# EAGLE design hub (EAGLE 7.5.0)
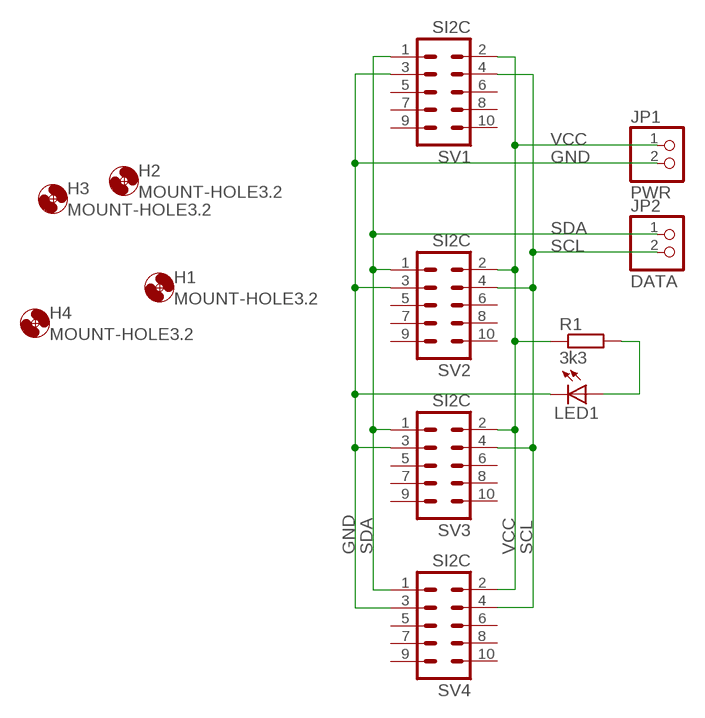
[diagram p0: schematic, sheet 1]

## Parts
H1  MOUNT-HOLE3.2  [3,2]
H2  MOUNT-HOLE3.2  [3,2]
H3  MOUNT-HOLE3.2  [3,2]
H4  MOUNT-HOLE3.2  [3,2]
JP1  PWR  PINHD-1X2  [1X02]
JP2  DATA  PINHD-1X2  [1X02]
LED1  LED3MM  [LED3MM]
R1  3k3  R-EU_0204/7  [0204/7]
SV1  SI2C  ML10  [ML10]
SV2  SI2C  ML10  [ML10]
SV3  SI2C  ML10  [ML10]
SV4  SI2C  ML10  [ML10]

## Nets
GND: JP1.2 LED1.K(C) SV1.3 SV2.3 SV3.3 SV4.3
N$1: LED1.A R1.2
SCL: JP2.2 SV1.4 SV2.4 SV3.4 SV4.4
SDA: JP2.1 SV1.1 SV2.1 SV3.1 SV4.1
VCC: JP1.1 R1.1 SV1.2 SV2.2 SV3.2 SV4.2
Unconnected: SV1.5 SV1.6 SV1.7 SV1.8 SV1.9 SV1.10 SV2.5 SV2.6 SV2.7 SV2.8 SV2.9 SV2.10 SV3.5 SV3.6 SV3.7 SV3.8 SV3.9 SV3.10 SV4.5 SV4.6 SV4.7 SV4.8 SV4.9 SV4.10

## Library data of the parts
H1-H4 = holes:MOUNT-HOLE: MOUNTING HOLE with drill center marker
JP1 JP2 = pinhead:PINHD-1X2: PIN HEADER
LED1 = led:LED: LED OSRAM: - CHIPLED LG R971, LG N971, LY N971, LG Q971, LY Q971, LO R971, LY R971 LH N974, LH R974 LS Q976, LO Q976, LY Q976 LO Q996 - Hyper CHIPLED LW Q18S LB Q993, LB Q99A, LB R99A - SideLED LS A670, LO A670, LY A670, LG A670, LP A670 LB A673, LV A673, LT A673, LW A673 LH A674 LY A675 LS A676, LA A676, LO A676, LY A676, LW A676 LS A679, LY A679, LG A679 - Hyper Micro SIDELED® LS Y876, LA Y876, LO Y876, LY Y876 LT Y87S - SmartLED LW L88C, LW L88S LB L89C, LB L89S, LG L890 LS L89K, LO L89K, LY L89K LS L896, LA L896, LO L896, LY L896 - TOPLED LS T670, LO T670, LY T670, LG T670, LP T670 LSG T670, LSP T670, LSY T670, LOP T670, LYG T670 LG T671, LOG T671, LSG T671 LB T673, LV T673, LT T673, LW T673 LH T674 LS T676, LA T676, LO T676, LY T676, LB T676, LH T676, LSB T676, LW T676 LB T67C, LV T67C, LT T67C, LS T67K, LO T67K, LY T67K, LW E67C LS E67B, LA E67B, LO E67B, LY E67B, LB E67C, LV E67C, LT E67C LW T67C LS T679, LY T679, LG T679 LS T770, LO T770, LY T770, LG T770, LP T770 LB T773, LV T773, LT T773, LW T773 LH T774 LS E675, LA E675, LY E675, LS T675 LS T776, LA T776, LO T776, LY T776, LB T776 LHGB T686 LT T68C, LB T68C - Hyper Mini TOPLED® LB M676 - Mini TOPLED Santana® LG M470 LS M47K, LO M47K, LY M47K Source: http://www.osram.convergy.de LUXEON: - LUMILED® LXK2-PW12-R00, LXK2-PW12-S00, LXK2-PW14-U00, LXK2-PW14-V00 LXK2-PM12-R00, LXK2-PM12-S00, LXK2-PM14-U00 LXK2-PE12-Q00, LXK2-PE12-R00, LXK2-PE12-S00, LXK2-PE14-T00, LXK2-PE14-U00 LXK2-PB12-K00, LXK2-PB12-L00, LXK2-PB12-M00, LXK2-PB14-N00, LXK2-PB14-P00, LXK2-PB14-Q00 LXK2-PR12-L00, LXK2-PR12-M00, LXK2-PR14-Q00, LXK2-PR14-R00 LXK2-PD12-Q00, LXK2-PD12-R00, LXK2-PD12-S00 LXK2-PH12-R00, LXK2-PH12-S00 LXK2-PL12-P00, LXK2-PL12-Q00, LXK2-PL12-R00 Source: www.luxeon.com KINGBRIGHT: KA-3528ASYC Source: www.kingbright.com
R1 = rcl:R-EU_: RESISTOR, European symbol
SV1-SV4 = con-harting-ml-derf:ML10: HARTING; OC_FARNELL: unknown; OC_NEWARK: unknown

## Net classes
0 default: clearance 0.205 mm

## Board
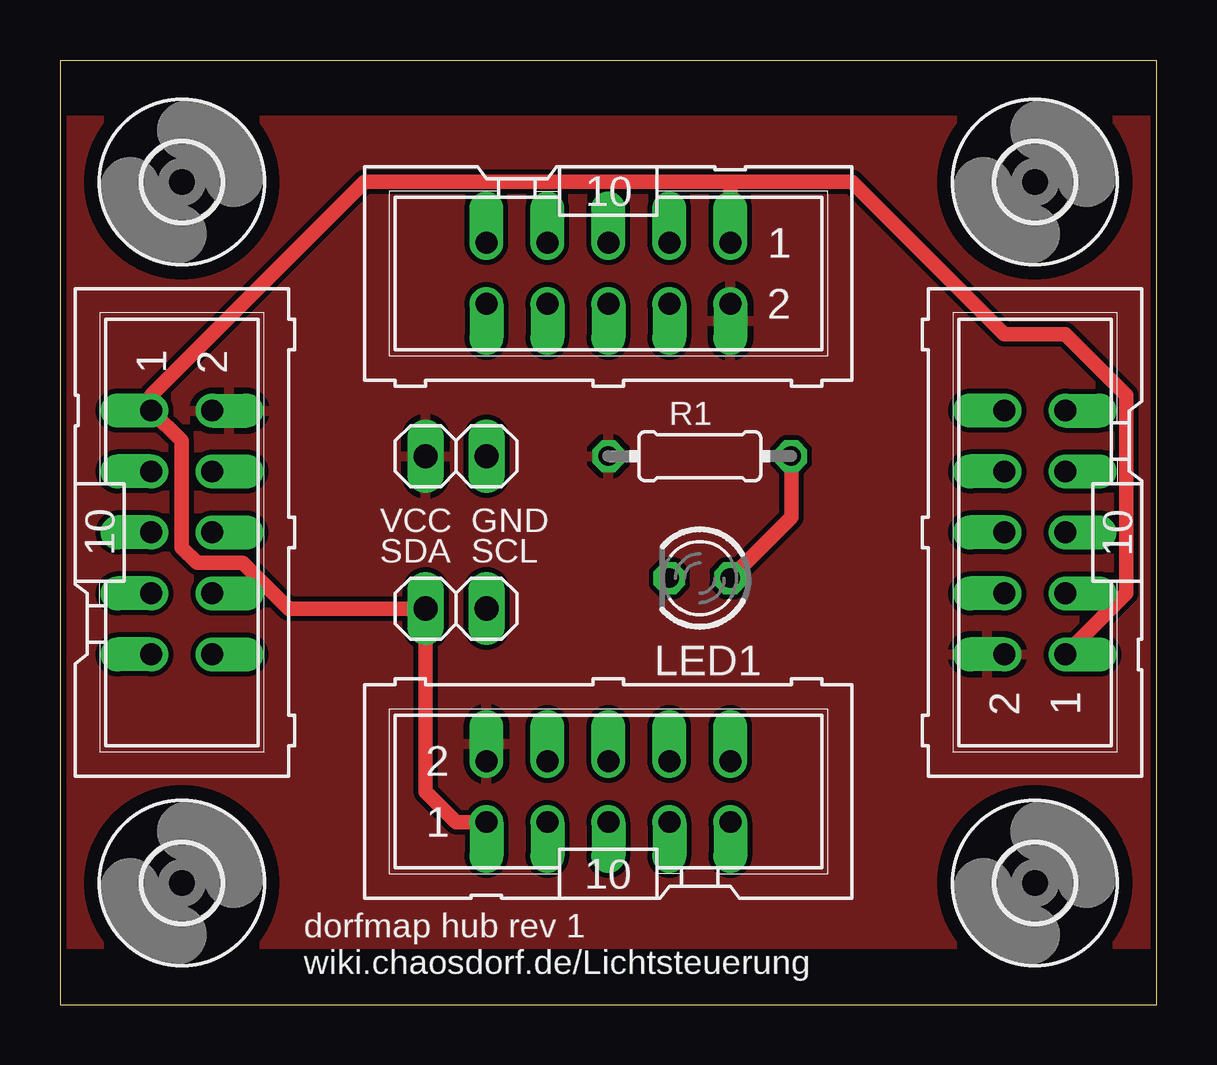
[diagram p1: board, top side]
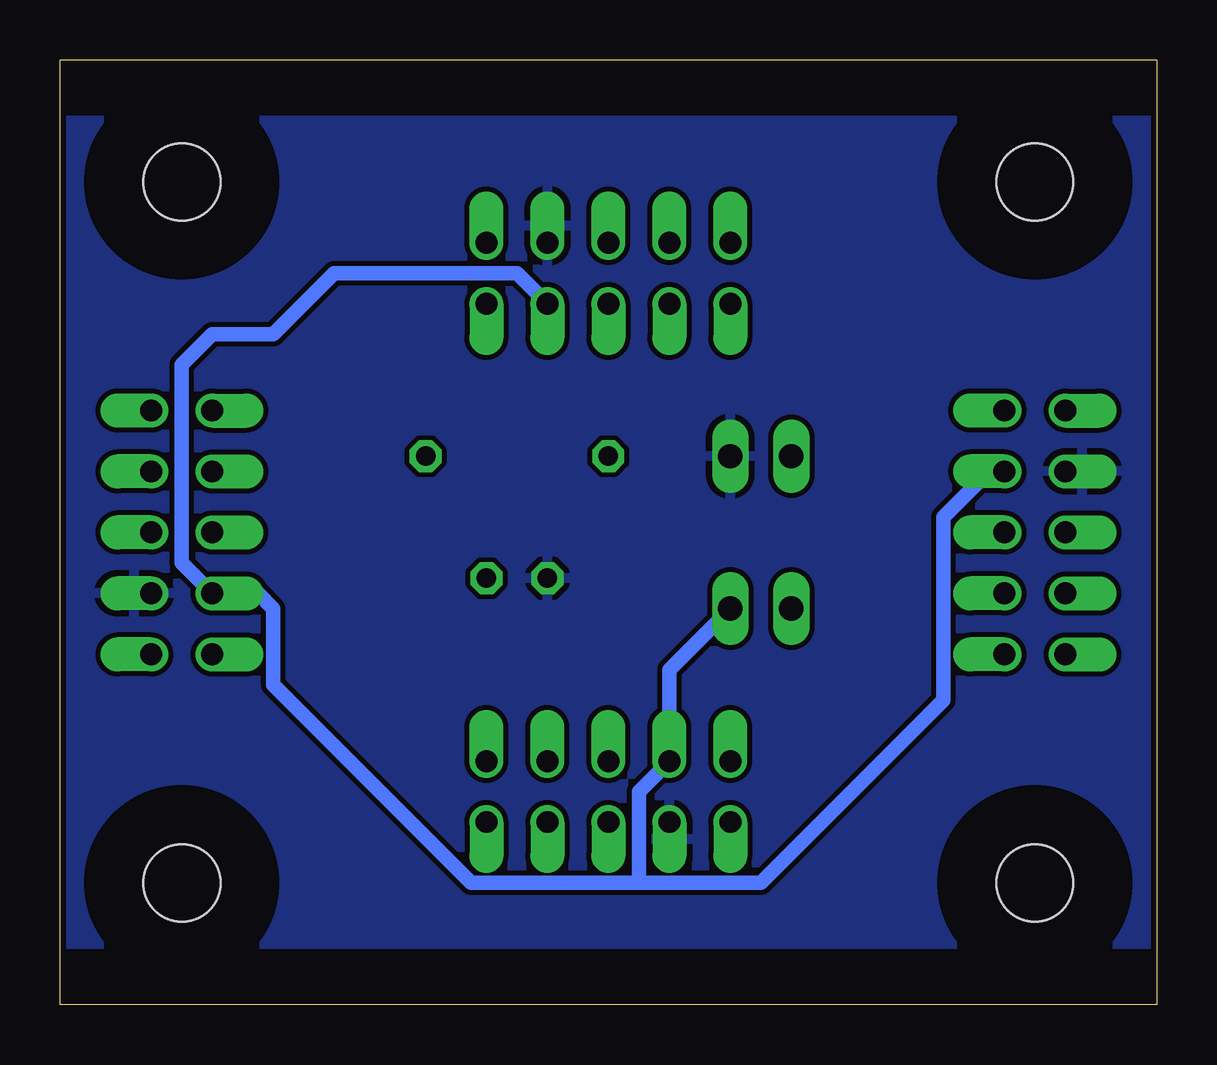
[diagram p2: board, bottom side, seen from below]

Size 45.72 x 39.37 mm. Coordinates in mm from the lower left corner, seen from the top.
Outline: 0,0 45.72,0 45.72,39.37 0,39.37 0,0
Copper layers (1*16): Top 0.035mm / dielectric 1.5mm / Bottom 0.035mm
Design rules "dirtypcbs_v1 *": minimum track width 5mil, minimum drill 12mil, track to track 5mil, track to pad 5mil, pad to pad 5mil, via to via 5mil, smd to smd 0mil, copper to edge 10mil, drill to drill 10mil, minimum pad ring 10mil, minimum via ring 6mil, stop-mask expansion 2mil, vias tented up to drill 25mil, thermal gap 10mil

### Footprints (pad centres in the part's own frame; a part is rotated, then mirrored left to right if it is on the bottom)
3,2 = hole 3.2: 0,0
1X02 = drill 1.016 long: 1 -1.27,0; 2 1.27,0
LED3MM = drill 0.813 octagon: A -1.27,0; K 1.27,0
0204/7 = drill 0.813 octagon: 1 -3.81,0; 2 3.81,0
ML10 = drill 0.914 offset: 1 -5.08,-1.27; 2 -5.08,1.27; 3 -2.54,-1.27; 4 -2.54,1.27; 5 0,-1.27; 6 0,1.27; 7 2.54,-1.27; 8 2.54,1.27; 9 5.08,-1.27; 10 5.08,1.27

### Placement (x,y rotation side)
H1  5.08,34.29 0 top
H2  5.08,5.08 0 top
H3  40.64,34.29 0 top
H4  40.64,5.08 0 top
JP1  16.51,22.86 0 top
JP2  16.51,16.51 0 top
LED1  26.67,17.78 180 top
R1  26.67,22.86 0 top
SV1  5.08,19.68 270 top
SV2  40.64,19.68 90 top
SV3  22.86,30.48 180 top
SV4  22.86,8.89 0 top

### Tracks (layer width: path | path; a pad name or v marks a point on that pad's centre or on a via)
GND
  pour Bottom: 0,2.54 0,36.83 45.72,36.83 45.72,2.54
N$1
  Top 0.61: R1.2 30.48,20.32 LED1.A
SCL
  Bottom 0.61: SV1.4 6.99,22.23 8.89,20.32 8.89,12.7 16.51,5.08 21.59,5.08 | 21.59,5.08 28.57,5.08 36.83,13.34 36.83,16.51 37.47,17.14 SV2.4 40.64,18.41 40.64,26.67 39.37,27.94 36.83,27.94 34.29,30.48 26.67,30.48 SV3.4 | 21.59,5.08 21.59,8.89 SV4.4 20.32,13.97 JP2.2
SDA
  Top 0.61: 27.94,34.29 12.7,34.29 3.81,25.4 SV1.1 5.08,23.5 5.08,19.05 5.71,18.41 7.62,18.41 9.53,16.51 JP2.1 15.24,8.89 16.51,7.62 SV4.1 | 27.94,34.29 33.02,34.29 39.37,27.94 41.91,27.94 44.45,25.4 44.45,17.14 SV2.1 | SV3.1 27.94,34.29
VCC
  pour Top: 0,2.54 45.72,2.54 45.72,36.83 0,36.83

### Text on the board
tNames: VCC | GND | SDA | SCL | dorfmap hub rev 1 / wiki.chaosdorf.de/Lichtsteuerung